# Altium schematic sheet STM32F302VC_EVM.SchDoc
size A4; Organization: Altium Limited; Address1: L3, 12a Rodborough Rd; Address2: Frenchs Forest; Address3: NSW; Address4: Australia 2086; DocumentNumber: 1; SheetNumber: 1; SheetTotal: 5
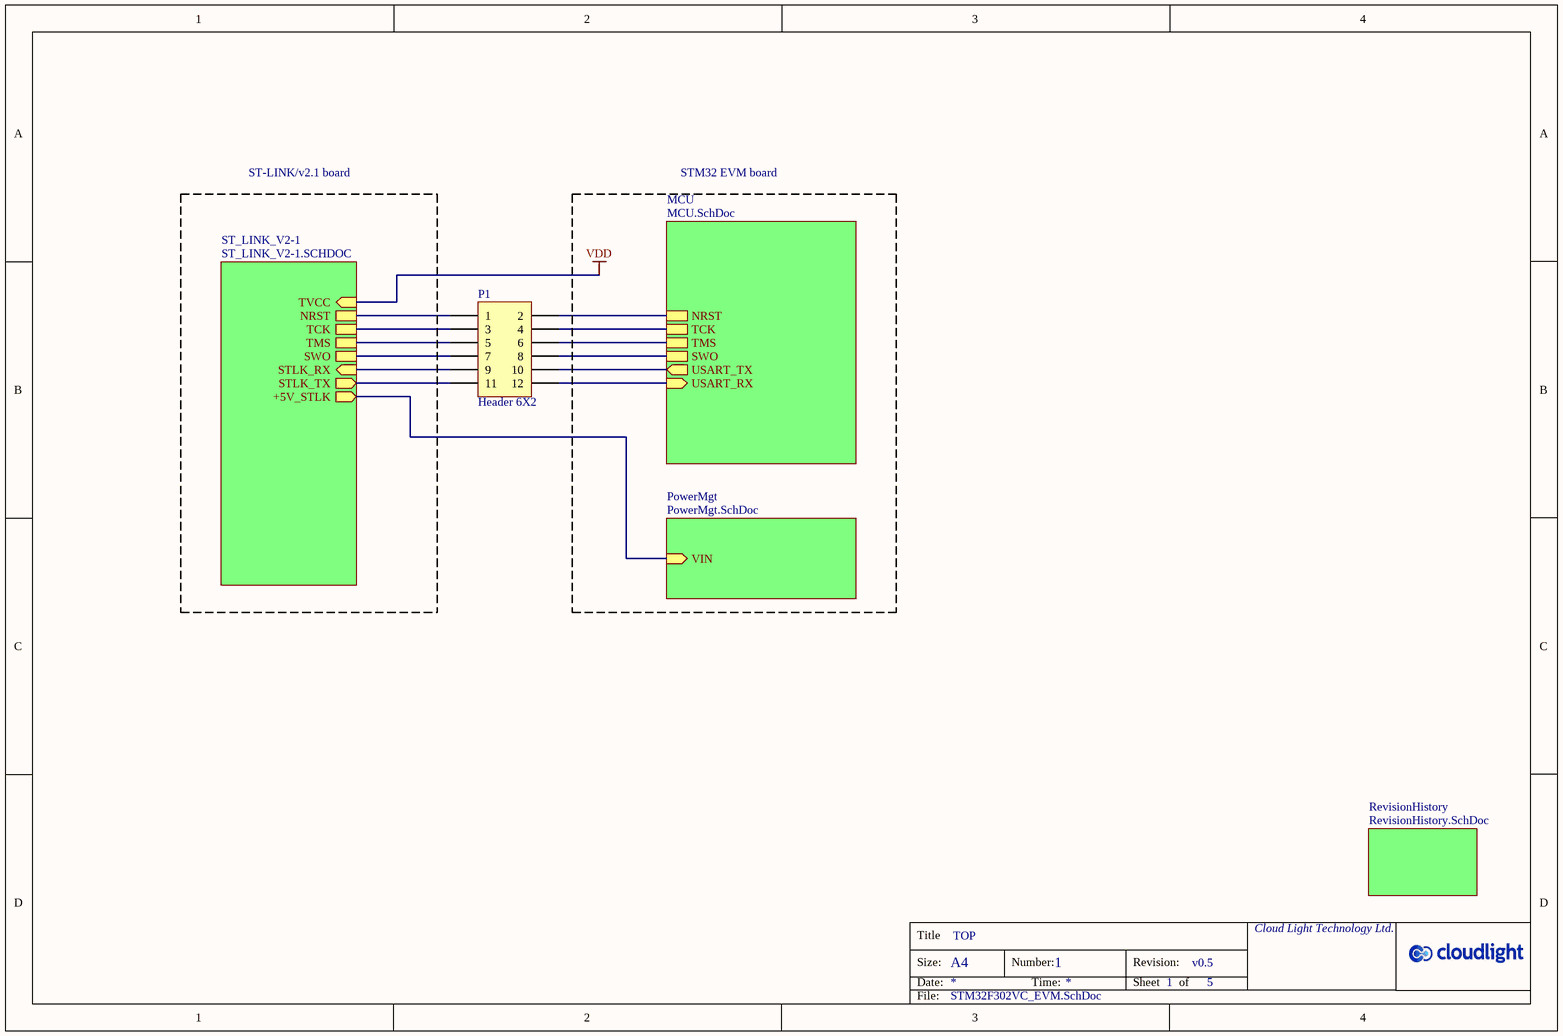
[diagram p0: STM32F302VC_EVM.SchDoc]

## Parts
P1  Header 6X2  [HDR2X6]

## Sub-sheets
MCU = MCU.SchDoc: NRST, USART_RX (in), USART_TX (out), TCK, TMS, SWO
PowerMgt = PowerMgt.SchDoc: VIN
RevisionHistory = RevisionHistory.SchDoc: no entries
ST_LINK_V2-1 = ST_LINK_V2-1.SCHDOC: TMS, TCK, NRST, STLK_RX (in), STLK_TX (out), SWO, +5V_STLK, TVCC

## Nets
VDD: sheet ST_LINK_V2-1/TVCC
NetP1_1: P1.1 ; sheet ST_LINK_V2-1/NRST
NetP1_2: P1.2 ; sheet MCU/NRST
NetP1_3: P1.3 ; sheet ST_LINK_V2-1/TCK
NetP1_4: P1.4 ; sheet MCU/TCK
NetP1_5: P1.5 ; sheet ST_LINK_V2-1/TMS
NetP1_6: P1.6 ; sheet MCU/TMS
NetP1_7: P1.7 ; sheet ST_LINK_V2-1/SWO
NetP1_8: P1.8 ; sheet MCU/SWO
NetP1_9: P1.9 ; sheet ST_LINK_V2-1/STLK_RX
NetP1_10: P1.10 ; sheet MCU/USART_TX
NetP1_11: P1.11 ; sheet ST_LINK_V2-1/STLK_TX
NetP1_12: P1.12 ; sheet MCU/USART_RX
(unnamed): sheet PowerMgt/VIN, sheet ST_LINK_V2-1/+5V_STLK

## Notes on the sheet
- ST-LINK/v2.1 board
- STM32 EVM board
- Title
- Size:
- Date:
- A4
- TOP
- Number:
- Time:
- Revision:
- Sheet
- 1
- of
- v0.5
- 5
- Cloud Light Technology Ltd.
- File:
- STM32F302VC_EVM.SchDoc

## Library data of the parts
P1 = Header 6X2: Header, 6-Pin, Dual row; Manufacturer: [N/A]; LatestRevisionDate: 17-Jul-2002; LatestRevisionNote: Re-released for DXP Platform.; Publisher: Altium Limited; PartNumber: [N/A]; Package: HDR2X6/T2.54/B2B; PackageDescription: Connector; Header; 2X6 Position; Pitch 2.54mm; Style Board to Board;; Supplier 1: [N/A]; Supplier Part Number 1: [N/A]